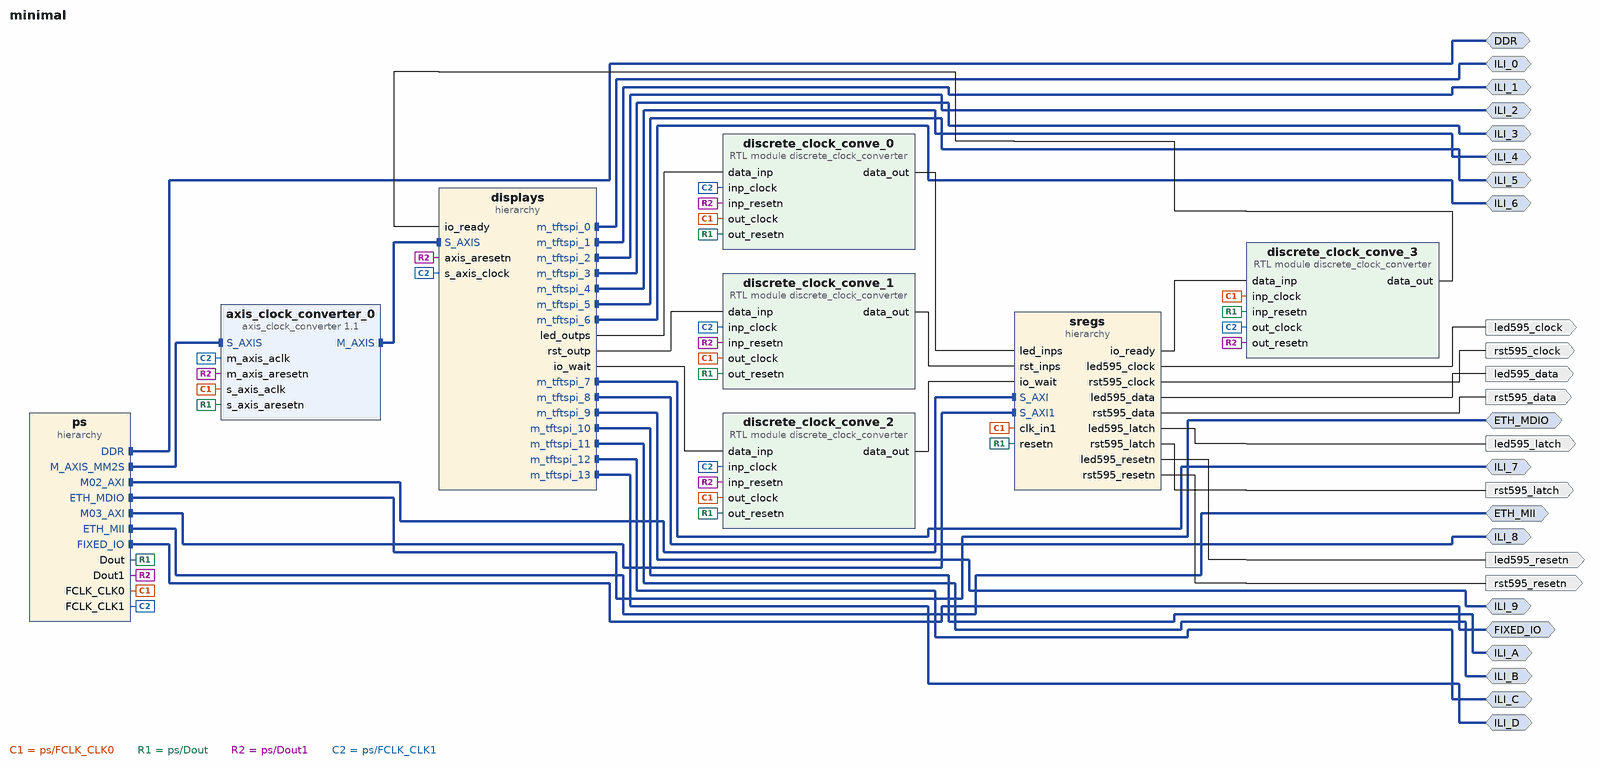
[diagram p0: block diagram of the top level]
# Vivado block design minimal, xc7z010clg400-1, Vivado 2025.2
create_bd_design minimal

create_bd_intf_port -mode Master -vlnv xilinx.com:interface:ddrx_rtl:1.0 DDR
create_bd_intf_port -mode Master -vlnv xilinx.com:display_processing_system7:fixedio_rtl:1.0 FIXED_IO
create_bd_intf_port -mode Master -vlnv xilinx.com:interface:mdio_rtl:1.0 ETH_MDIO
create_bd_intf_port -mode Master -vlnv xilinx.com:interface:mii_rtl:1.0 ETH_MII
create_bd_intf_port -mode Master -vlnv kn4hji.ddns.net:interface:tftspi_rtl:1.0 ILI_1
create_bd_intf_port -mode Master -vlnv kn4hji.ddns.net:interface:tftspi_rtl:1.0 ILI_5
create_bd_intf_port -mode Master -vlnv kn4hji.ddns.net:interface:tftspi_rtl:1.0 ILI_D
create_bd_intf_port -mode Master -vlnv kn4hji.ddns.net:interface:tftspi_rtl:1.0 ILI_C
create_bd_intf_port -mode Master -vlnv kn4hji.ddns.net:interface:tftspi_rtl:1.0 ILI_B
create_bd_intf_port -mode Master -vlnv kn4hji.ddns.net:interface:tftspi_rtl:1.0 ILI_0
create_bd_intf_port -mode Master -vlnv kn4hji.ddns.net:interface:tftspi_rtl:1.0 ILI_A
create_bd_intf_port -mode Master -vlnv kn4hji.ddns.net:interface:tftspi_rtl:1.0 ILI_2
create_bd_intf_port -mode Master -vlnv kn4hji.ddns.net:interface:tftspi_rtl:1.0 ILI_3
create_bd_intf_port -mode Master -vlnv kn4hji.ddns.net:interface:tftspi_rtl:1.0 ILI_4
create_bd_intf_port -mode Master -vlnv kn4hji.ddns.net:interface:tftspi_rtl:1.0 ILI_6
create_bd_intf_port -mode Master -vlnv kn4hji.ddns.net:interface:tftspi_rtl:1.0 ILI_7
create_bd_intf_port -mode Master -vlnv kn4hji.ddns.net:interface:tftspi_rtl:1.0 ILI_8
create_bd_intf_port -mode Master -vlnv kn4hji.ddns.net:interface:tftspi_rtl:1.0 ILI_9
create_bd_port -dir O -type clk rst595_clock
set_property -dict {CONFIG.ASSOCIATED_RESET rst595_resetn CONFIG.FREQ_HZ 25000000} [get_bd_ports rst595_clock]
create_bd_port -dir O rst595_latch
create_bd_port -dir O -type rst rst595_resetn
create_bd_port -dir O rst595_data
create_bd_port -dir O -type clk led595_clock
set_property -dict {CONFIG.ASSOCIATED_RESET led595_resetn CONFIG.FREQ_HZ 25000000} [get_bd_ports led595_clock]
create_bd_port -dir O led595_latch
create_bd_port -dir O -type rst led595_resetn
create_bd_port -dir O led595_data

create_bd_cell -type hier sregs
create_bd_cell -type hier displays
create_bd_cell -type hier ps
create_bd_cell -type ip -vlnv xilinx.com:ip:axis_clock_converter:1.1 axis_clock_converter_0
create_bd_cell -type module -reference discrete_clock_converter discrete_clock_conve_0
set_property -dict {CONFIG.DATA_WIDTH 14} [get_bd_cells discrete_clock_conve_0]
create_bd_cell -type module -reference discrete_clock_converter discrete_clock_conve_1
set_property -dict {CONFIG.DATA_WIDTH 14} [get_bd_cells discrete_clock_conve_1]
create_bd_cell -type module -reference discrete_clock_converter discrete_clock_conve_2
set_property -dict {CONFIG.DATA_WIDTH 1 CONFIG.RESET_VAL 1} [get_bd_cells discrete_clock_conve_2]
create_bd_cell -type module -reference discrete_clock_converter discrete_clock_conve_3
set_property -dict {CONFIG.DATA_WIDTH 1} [get_bd_cells discrete_clock_conve_3]

# ---- hierarchy /sregs ----
current_bd_instance /sregs
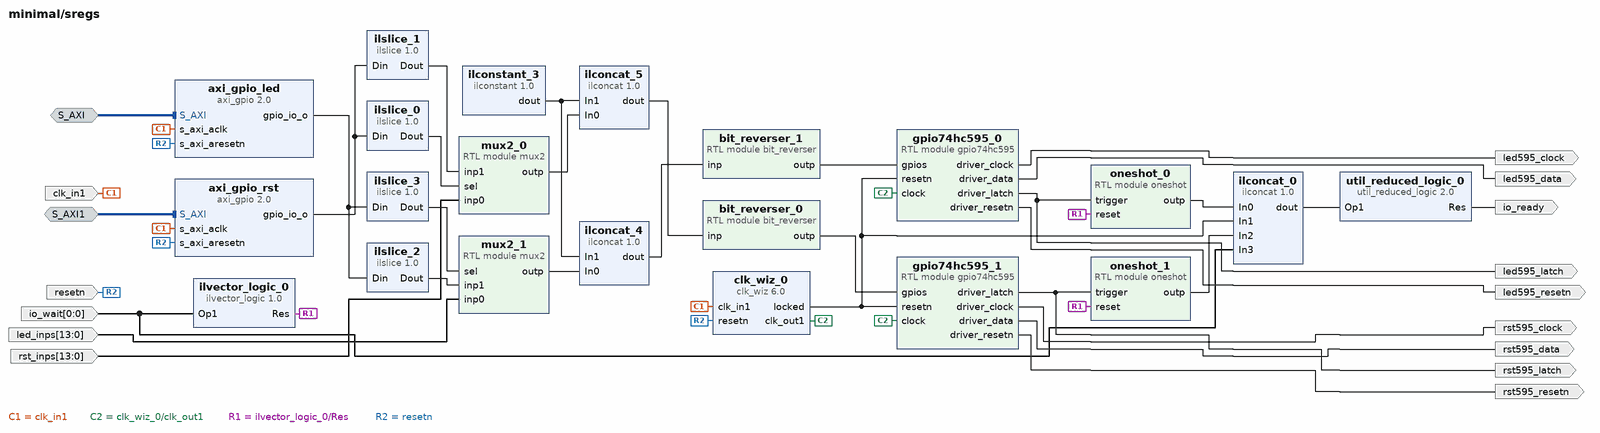
[diagram p1: block diagram inside /sregs]
create_bd_intf_pin -mode Slave -vlnv xilinx.com:interface:aximm_rtl:1.0 S_AXI
create_bd_intf_pin -mode Slave -vlnv xilinx.com:interface:aximm_rtl:1.0 S_AXI1
create_bd_pin -dir O -type clk led595_clock
create_bd_pin -dir O led595_latch
create_bd_pin -dir O -type rst led595_resetn
create_bd_pin -dir O led595_data
create_bd_pin -dir O -type clk rst595_clock
create_bd_pin -dir O rst595_latch
create_bd_pin -dir O -type rst rst595_resetn
create_bd_pin -dir O rst595_data
create_bd_pin -dir I -type rst resetn
create_bd_pin -dir I -type clk clk_in1
create_bd_pin -dir I -from 0 -to 0 io_wait
create_bd_pin -dir O io_ready
create_bd_pin -dir I -from 13 -to 0 led_inps
create_bd_pin -dir I -from 13 -to 0 rst_inps

create_bd_cell -type inline_hdl -vlnv xilinx.com:inline_hdl:ilconcat:1.0 ilconcat_4
set_property -dict {CONFIG.IN0_WIDTH 14 CONFIG.IN1_WIDTH 10 CONFIG.NUM_PORTS 2} [get_bd_cells ilconcat_4]
create_bd_cell -type ip -vlnv xilinx.com:ip:clk_wiz:6.0 clk_wiz_0
set_property -dict [list \
  CONFIG.CLKOUT1_DRIVES BUFGCE \
  CONFIG.CLKOUT1_JITTER 251.196 \
  CONFIG.CLKOUT1_PHASE_ERROR 114.212 \
  CONFIG.CLKOUT1_REQUESTED_OUT_FREQ 6.25 \
  CONFIG.CLKOUT2_DRIVES BUFGCE \
  CONFIG.CLKOUT3_DRIVES BUFGCE \
  CONFIG.CLKOUT4_DRIVES BUFGCE \
  CONFIG.CLKOUT5_DRIVES BUFGCE \
  CONFIG.CLKOUT6_DRIVES BUFGCE \
  CONFIG.CLKOUT7_DRIVES BUFGCE \
  CONFIG.ENABLE_CLOCK_MONITOR false \
  CONFIG.FEEDBACK_SOURCE FDBK_AUTO \
  CONFIG.MMCM_BANDWIDTH OPTIMIZED \
  CONFIG.MMCM_CLKFBOUT_MULT_F 8 \
  CONFIG.MMCM_CLKIN1_PERIOD 10.0 \
  CONFIG.MMCM_CLKIN2_PERIOD 10.0 \
  CONFIG.MMCM_CLKOUT0_DIVIDE_F 128 \
  CONFIG.MMCM_COMPENSATION ZHOLD \
  CONFIG.MMCM_DIVCLK_DIVIDE 1 \
  CONFIG.PRIMITIVE PLL \
  CONFIG.RESET_PORT resetn \
  CONFIG.RESET_TYPE ACTIVE_LOW \
  CONFIG.SECONDARY_SOURCE Single_ended_clock_capable_pin \
  CONFIG.USE_FREQ_SYNTH true \
  CONFIG.USE_LOCKED true \
  CONFIG.USE_PHASE_ALIGNMENT true \
  CONFIG.USE_SAFE_CLOCK_STARTUP true \
] [get_bd_cells clk_wiz_0]
create_bd_cell -type inline_hdl -vlnv xilinx.com:inline_hdl:ilconstant:1.0 ilconstant_3
set_property -dict {CONFIG.CONST_VAL 0x0000 CONFIG.CONST_WIDTH 10} [get_bd_cells ilconstant_3]
create_bd_cell -type module -reference gpio74hc595 gpio74hc595_0
set_property -dict {CONFIG.REGISTER_COUNT 3} [get_bd_cells gpio74hc595_0]
create_bd_cell -type module -reference gpio74hc595 gpio74hc595_1
set_property -dict {CONFIG.REGISTER_COUNT 3} [get_bd_cells gpio74hc595_1]
create_bd_cell -type inline_hdl -vlnv xilinx.com:inline_hdl:ilconcat:1.0 ilconcat_0
set_property -dict {CONFIG.NUM_PORTS 4} [get_bd_cells ilconcat_0]
create_bd_cell -type ip -vlnv xilinx.com:ip:util_reduced_logic:2.0 util_reduced_logic_0
set_property -dict {CONFIG.C_OPERATION and CONFIG.C_SIZE 4} [get_bd_cells util_reduced_logic_0]
create_bd_cell -type module -reference oneshot oneshot_0
create_bd_cell -type module -reference oneshot oneshot_1
create_bd_cell -type inline_hdl -vlnv xilinx.com:inline_hdl:ilvector_logic:1.0 ilvector_logic_0
set_property -dict {CONFIG.C_OPERATION not CONFIG.C_SIZE 1} [get_bd_cells ilvector_logic_0]
create_bd_cell -type module -reference mux2 mux2_1
set_property -dict {CONFIG.DATA_WIDTH 14} [get_bd_cells mux2_1]
create_bd_cell -type module -reference mux2 mux2_0
set_property -dict {CONFIG.DATA_WIDTH 14} [get_bd_cells mux2_0]
create_bd_cell -type inline_hdl -vlnv xilinx.com:inline_hdl:ilslice:1.0 ilslice_1
set_property -dict {CONFIG.DIN_FROM 13 CONFIG.DIN_TO 0 CONFIG.DIN_WIDTH 15} [get_bd_cells ilslice_1]
create_bd_cell -type inline_hdl -vlnv xilinx.com:inline_hdl:ilslice:1.0 ilslice_0
set_property -dict {CONFIG.DIN_FROM 14 CONFIG.DIN_TO 14 CONFIG.DIN_WIDTH 15} [get_bd_cells ilslice_0]
create_bd_cell -type inline_hdl -vlnv xilinx.com:inline_hdl:ilslice:1.0 ilslice_2
set_property -dict {CONFIG.DIN_FROM 13 CONFIG.DIN_TO 0 CONFIG.DIN_WIDTH 15} [get_bd_cells ilslice_2]
create_bd_cell -type inline_hdl -vlnv xilinx.com:inline_hdl:ilslice:1.0 ilslice_3
set_property -dict {CONFIG.DIN_FROM 14 CONFIG.DIN_TO 14 CONFIG.DIN_WIDTH 15} [get_bd_cells ilslice_3]
create_bd_cell -type ip -vlnv xilinx.com:ip:axi_gpio:2.0 axi_gpio_led
set_property -dict {CONFIG.C_ALL_OUTPUTS 1 CONFIG.C_GPIO_WIDTH 15} [get_bd_cells axi_gpio_led]
create_bd_cell -type ip -vlnv xilinx.com:ip:axi_gpio:2.0 axi_gpio_rst
set_property -dict {CONFIG.C_ALL_OUTPUTS 1 CONFIG.C_GPIO_WIDTH 15} [get_bd_cells axi_gpio_rst]
create_bd_cell -type module -reference bit_reverser bit_reverser_0
set_property -dict {CONFIG.WORD_COUNT 1 CONFIG.WORD_SIZE 24} [get_bd_cells bit_reverser_0]
create_bd_cell -type module -reference bit_reverser bit_reverser_1
set_property -dict {CONFIG.WORD_COUNT 1 CONFIG.WORD_SIZE 24} [get_bd_cells bit_reverser_1]
create_bd_cell -type inline_hdl -vlnv xilinx.com:inline_hdl:ilconcat:1.0 ilconcat_5
set_property -dict {CONFIG.IN0_WIDTH 14 CONFIG.IN1_WIDTH 10 CONFIG.NUM_PORTS 2} [get_bd_cells ilconcat_5]

# ---- hierarchy /displays ----
current_bd_instance /displays
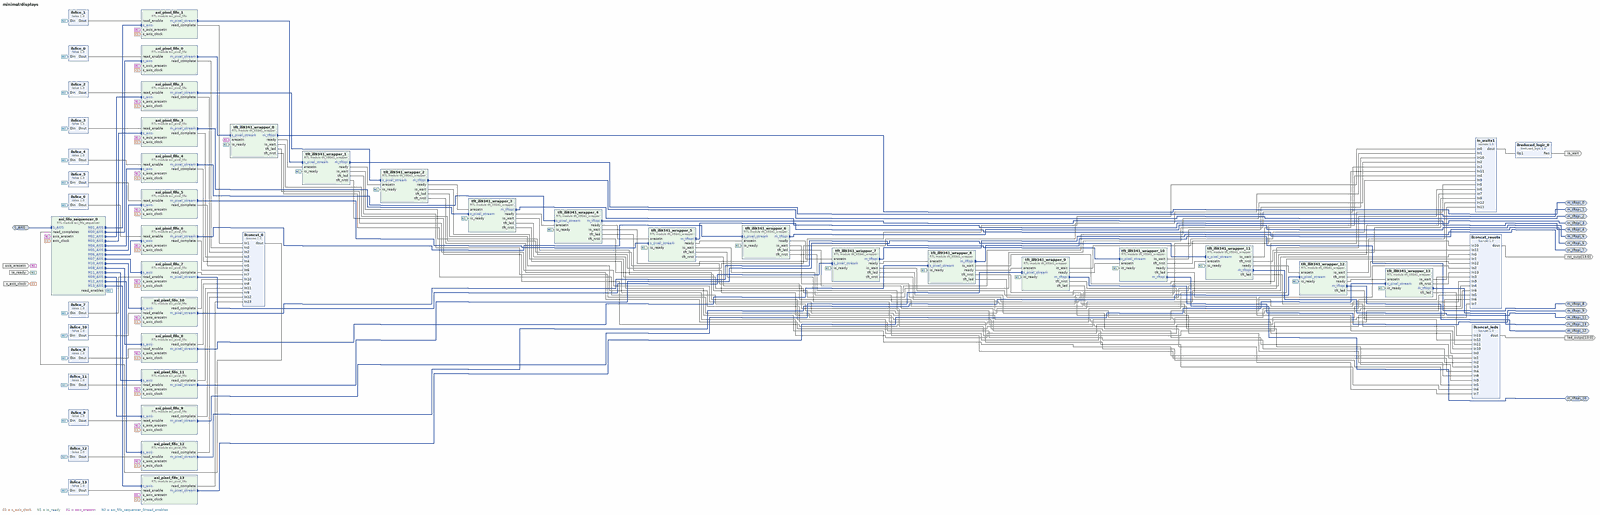
[diagram p2: block diagram inside /displays, whole]
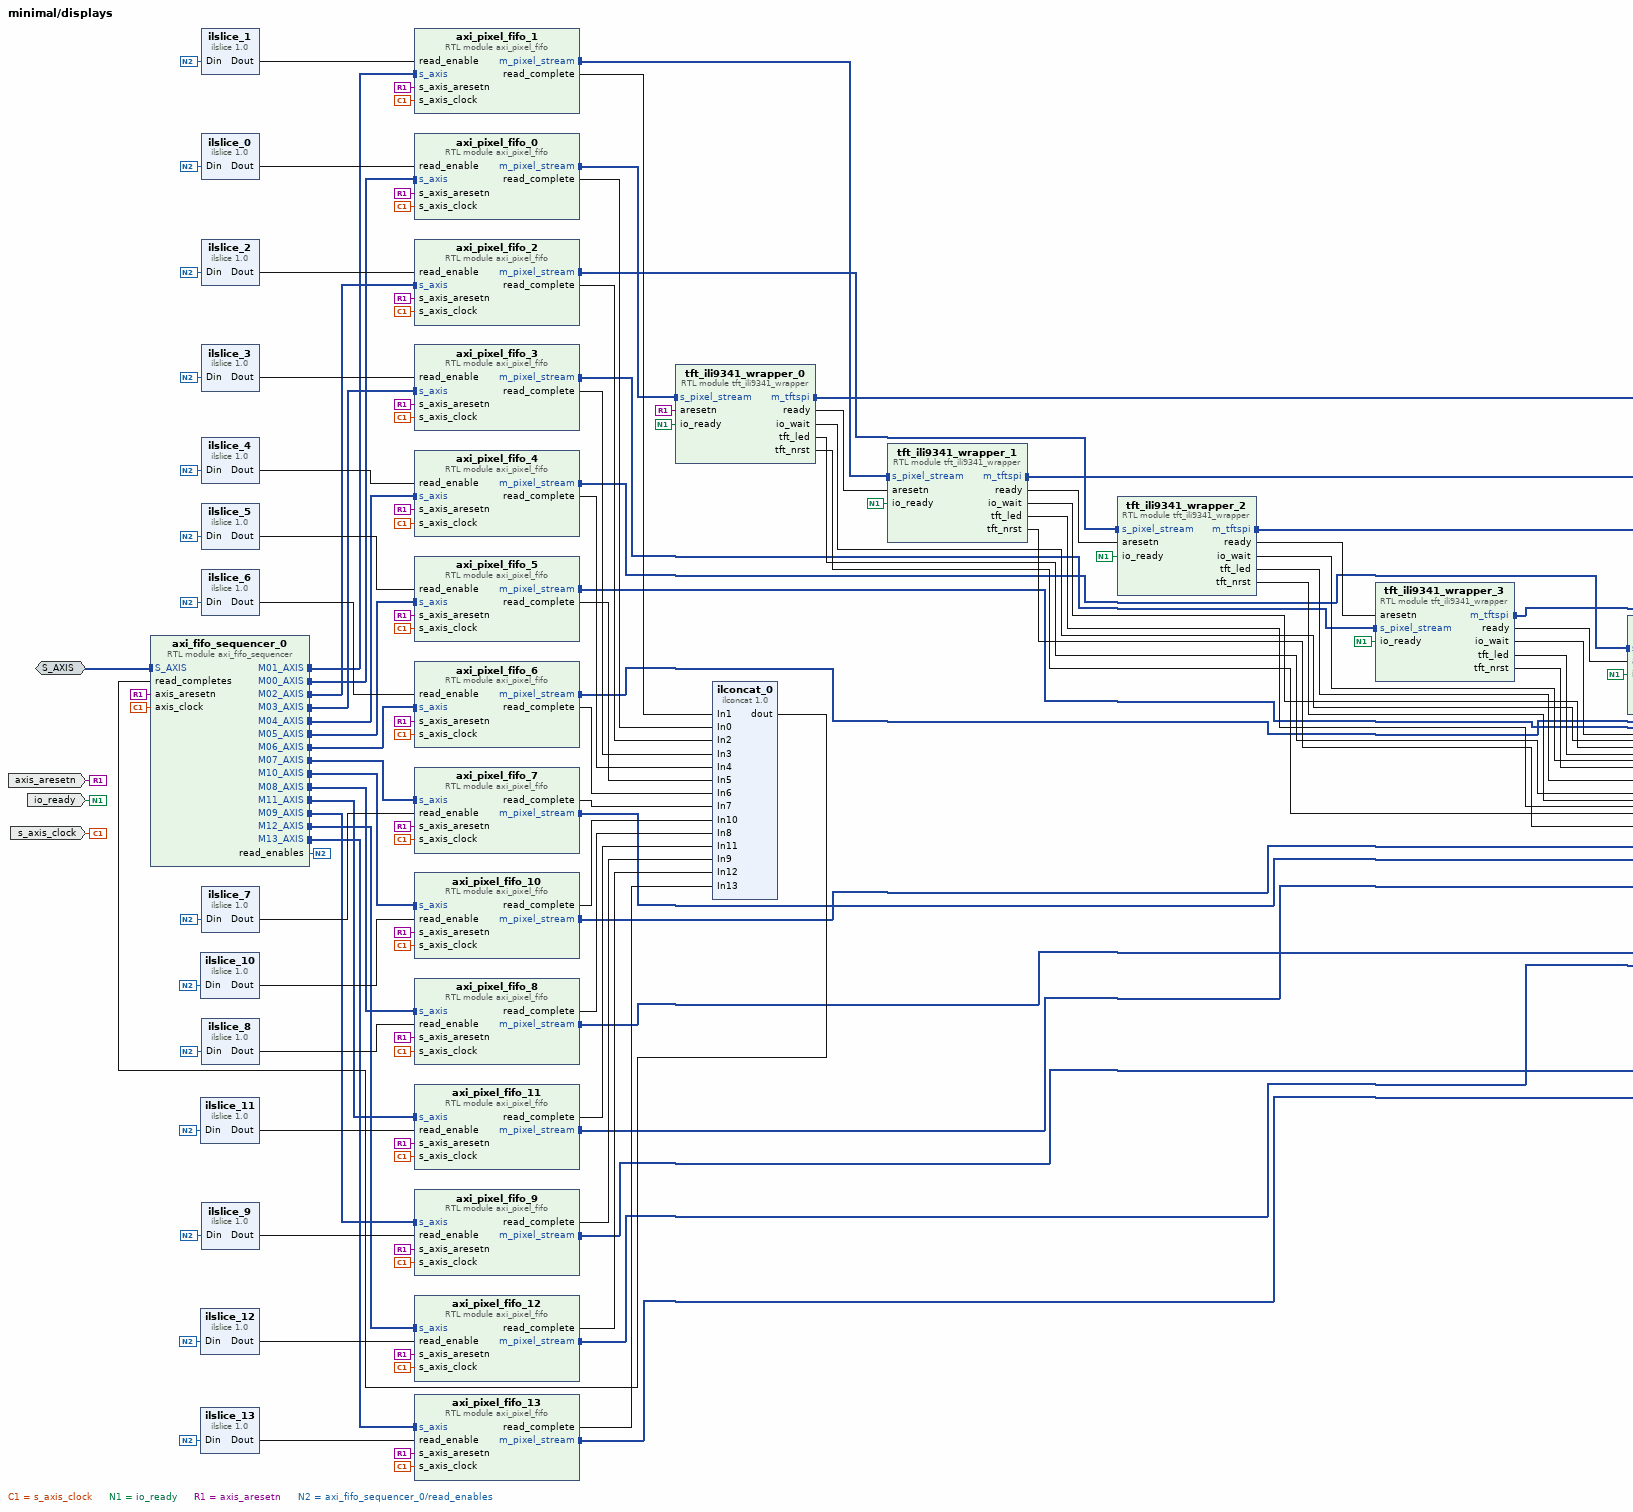
[diagram p3: block diagram inside /displays, left part]
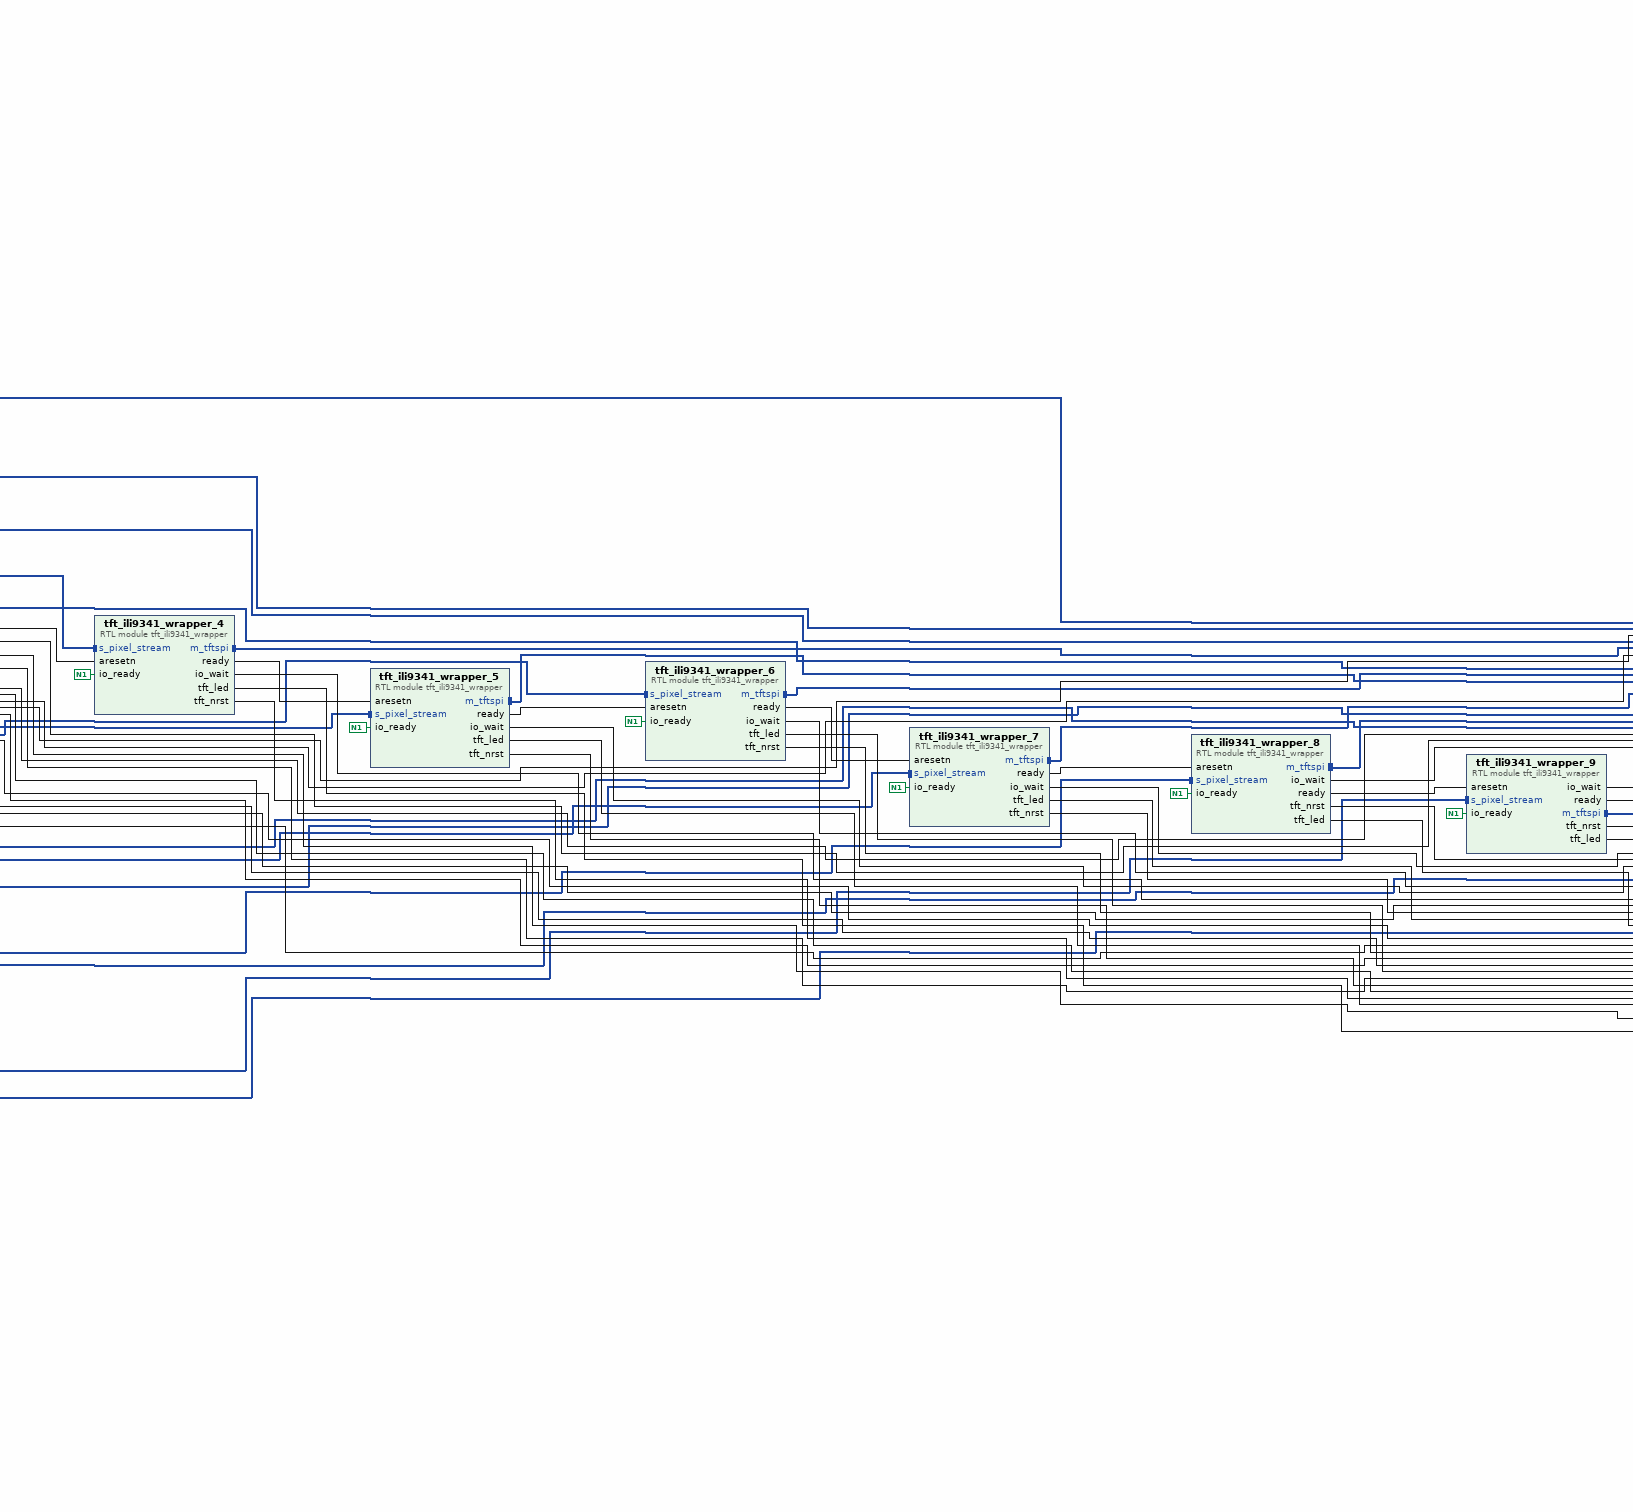
[diagram p4: block diagram inside /displays, centre part]
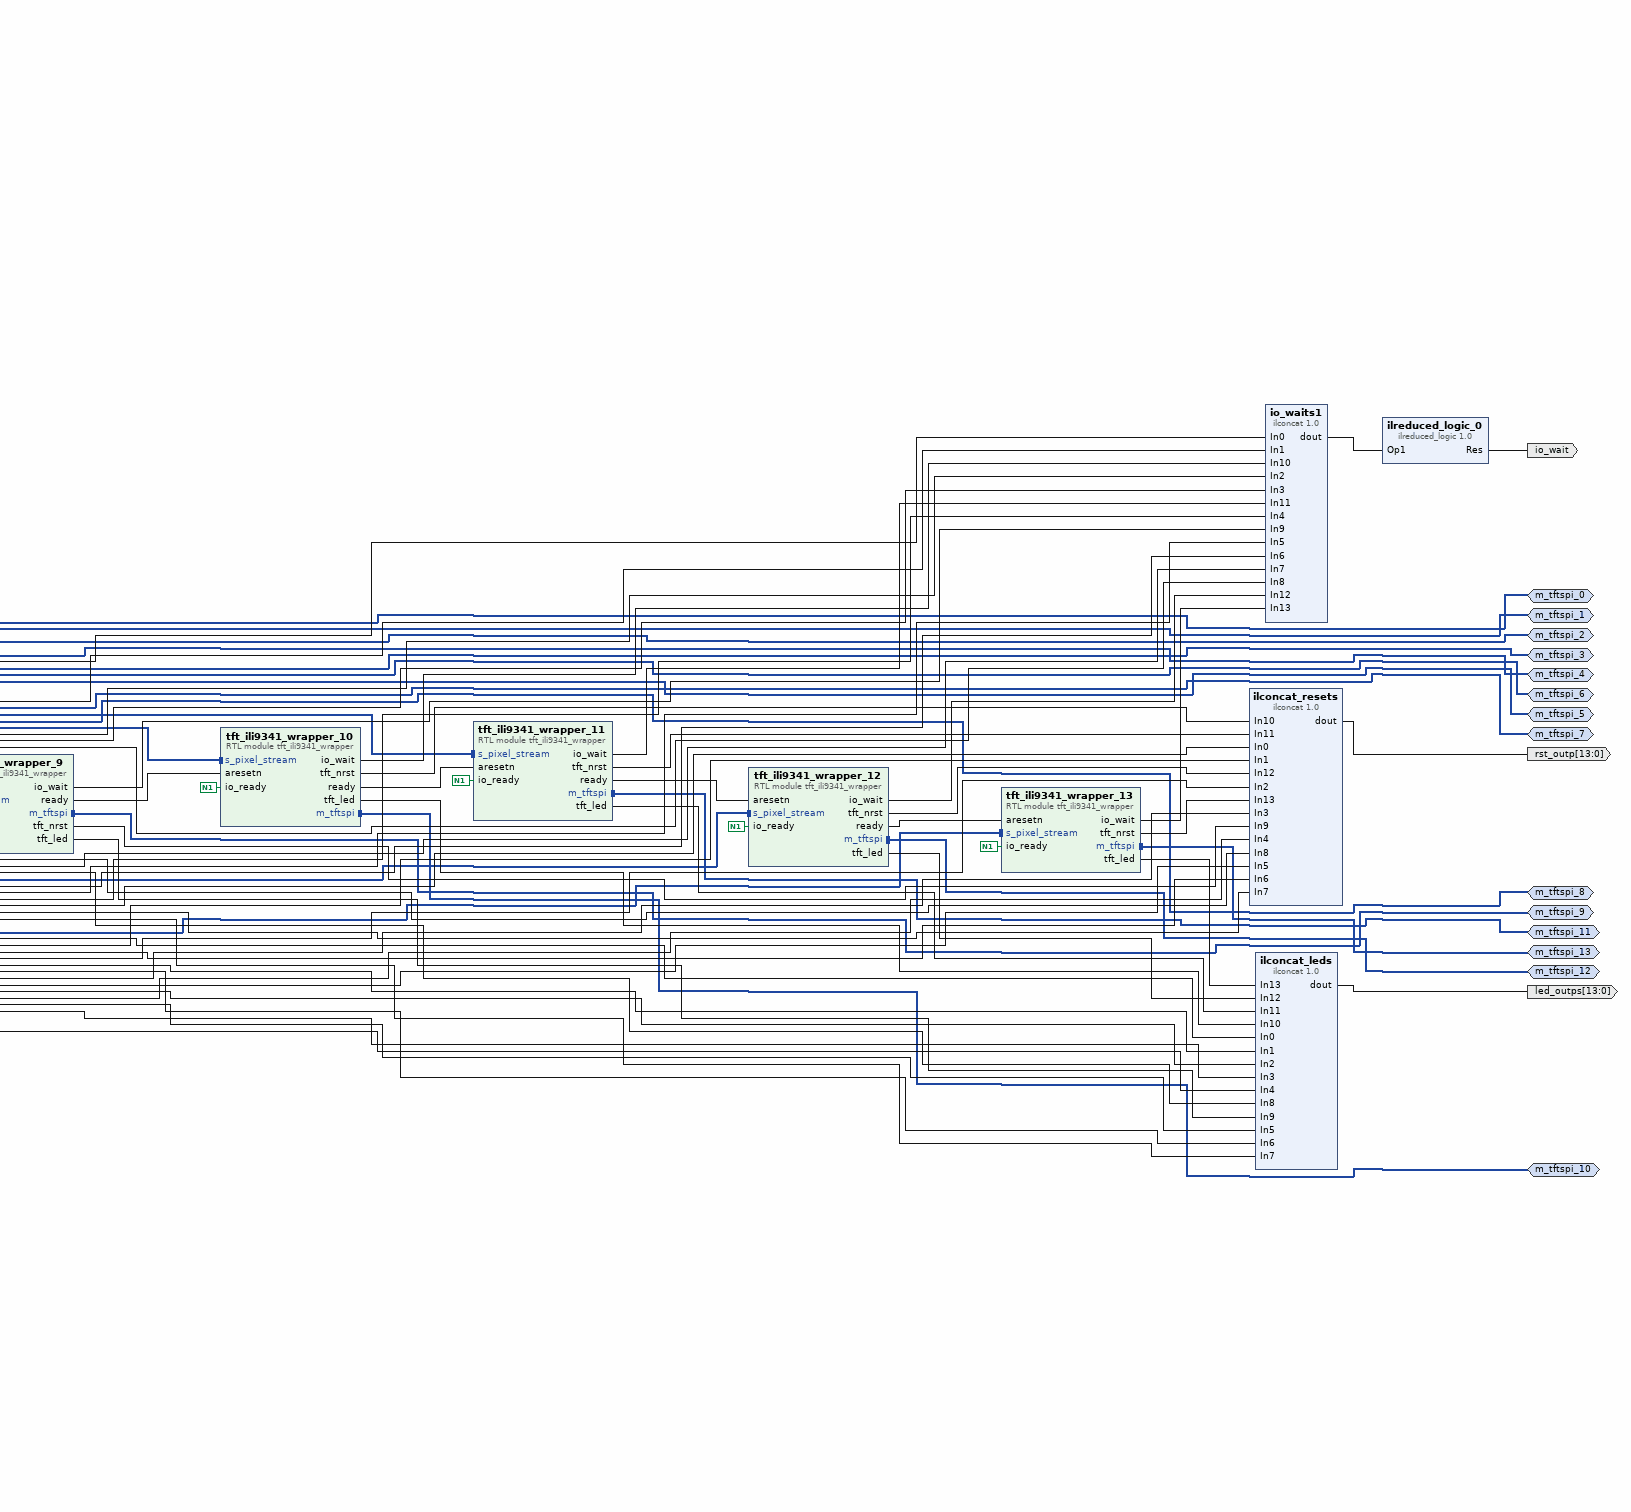
[diagram p5: block diagram inside /displays, right part]
create_bd_intf_pin -mode Master -vlnv kn4hji.ddns.net:interface:tftspi_rtl:1.0 m_tftspi_0
create_bd_intf_pin -mode Master -vlnv kn4hji.ddns.net:interface:tftspi_rtl:1.0 m_tftspi_2
create_bd_intf_pin -mode Master -vlnv kn4hji.ddns.net:interface:tftspi_rtl:1.0 m_tftspi_4
create_bd_intf_pin -mode Master -vlnv kn4hji.ddns.net:interface:tftspi_rtl:1.0 m_tftspi_3
create_bd_intf_pin -mode Master -vlnv kn4hji.ddns.net:interface:tftspi_rtl:1.0 m_tftspi_6
create_bd_intf_pin -mode Master -vlnv kn4hji.ddns.net:interface:tftspi_rtl:1.0 m_tftspi_7
create_bd_intf_pin -mode Master -vlnv kn4hji.ddns.net:interface:tftspi_rtl:1.0 m_tftspi_8
create_bd_intf_pin -mode Master -vlnv kn4hji.ddns.net:interface:tftspi_rtl:1.0 m_tftspi_9
create_bd_intf_pin -mode Master -vlnv kn4hji.ddns.net:interface:tftspi_rtl:1.0 m_tftspi_10
create_bd_intf_pin -mode Master -vlnv kn4hji.ddns.net:interface:tftspi_rtl:1.0 m_tftspi_11
create_bd_intf_pin -mode Master -vlnv kn4hji.ddns.net:interface:tftspi_rtl:1.0 m_tftspi_12
create_bd_intf_pin -mode Master -vlnv kn4hji.ddns.net:interface:tftspi_rtl:1.0 m_tftspi_13
create_bd_intf_pin -mode Master -vlnv kn4hji.ddns.net:interface:tftspi_rtl:1.0 m_tftspi_5
create_bd_intf_pin -mode Master -vlnv kn4hji.ddns.net:interface:tftspi_rtl:1.0 m_tftspi_1
create_bd_intf_pin -mode Slave -vlnv xilinx.com:interface:axis_rtl:1.0 S_AXIS
create_bd_pin -dir I -type clk s_axis_clock
create_bd_pin -dir I -type rst axis_aresetn
create_bd_pin -dir O -from 13 -to 0 rst_outp
create_bd_pin -dir O -from 13 -to 0 led_outps
create_bd_pin -dir I -type rst io_ready
create_bd_pin -dir O io_wait

create_bd_cell -type module -reference tft_ili9341_wrapper tft_ili9341_wrapper_0
set_property -dict {CONFIG.INPUT_CLK_MHZ 60} [get_bd_cells tft_ili9341_wrapper_0]
create_bd_cell -type module -reference axi_pixel_fifo axi_pixel_fifo_0
create_bd_cell -type module -reference axi_fifo_sequencer axi_fifo_sequencer_0
set_property -dict {CONFIG.LAST_DISPLAY 13 CONFIG.MAX_DISPLAYS 14} [get_bd_cells axi_fifo_sequencer_0]
create_bd_cell -type module -reference axi_pixel_fifo axi_pixel_fifo_1
create_bd_cell -type module -reference axi_pixel_fifo axi_pixel_fifo_2
create_bd_cell -type module -reference axi_pixel_fifo axi_pixel_fifo_3
create_bd_cell -type module -reference axi_pixel_fifo axi_pixel_fifo_4
create_bd_cell -type module -reference axi_pixel_fifo axi_pixel_fifo_5
create_bd_cell -type module -reference axi_pixel_fifo axi_pixel_fifo_6
create_bd_cell -type module -reference axi_pixel_fifo axi_pixel_fifo_7
create_bd_cell -type module -reference axi_pixel_fifo axi_pixel_fifo_8
create_bd_cell -type module -reference axi_pixel_fifo axi_pixel_fifo_9
create_bd_cell -type module -reference axi_pixel_fifo axi_pixel_fifo_10
create_bd_cell -type module -reference axi_pixel_fifo axi_pixel_fifo_11
create_bd_cell -type module -reference axi_pixel_fifo axi_pixel_fifo_12
create_bd_cell -type module -reference axi_pixel_fifo axi_pixel_fifo_13
create_bd_cell -type inline_hdl -vlnv xilinx.com:inline_hdl:ilslice:1.0 ilslice_0
set_property -dict {CONFIG.DIN_WIDTH 14} [get_bd_cells ilslice_0]
create_bd_cell -type inline_hdl -vlnv xilinx.com:inline_hdl:ilslice:1.0 ilslice_1
set_property -dict {CONFIG.DIN_FROM 1 CONFIG.DIN_TO 1 CONFIG.DIN_WIDTH 14} [get_bd_cells ilslice_1]
create_bd_cell -type inline_hdl -vlnv xilinx.com:inline_hdl:ilslice:1.0 ilslice_2
set_property -dict {CONFIG.DIN_FROM 2 CONFIG.DIN_TO 2 CONFIG.DIN_WIDTH 14} [get_bd_cells ilslice_2]
create_bd_cell -type inline_hdl -vlnv xilinx.com:inline_hdl:ilslice:1.0 ilslice_3
set_property -dict {CONFIG.DIN_FROM 3 CONFIG.DIN_TO 3 CONFIG.DIN_WIDTH 14} [get_bd_cells ilslice_3]
create_bd_cell -type inline_hdl -vlnv xilinx.com:inline_hdl:ilslice:1.0 ilslice_4
set_property -dict {CONFIG.DIN_FROM 4 CONFIG.DIN_TO 4 CONFIG.DIN_WIDTH 14} [get_bd_cells ilslice_4]
create_bd_cell -type inline_hdl -vlnv xilinx.com:inline_hdl:ilslice:1.0 ilslice_5
set_property -dict {CONFIG.DIN_FROM 5 CONFIG.DIN_TO 5 CONFIG.DIN_WIDTH 14} [get_bd_cells ilslice_5]
create_bd_cell -type inline_hdl -vlnv xilinx.com:inline_hdl:ilslice:1.0 ilslice_6
set_property -dict {CONFIG.DIN_FROM 6 CONFIG.DIN_TO 6 CONFIG.DIN_WIDTH 14} [get_bd_cells ilslice_6]
create_bd_cell -type inline_hdl -vlnv xilinx.com:inline_hdl:ilslice:1.0 ilslice_7
set_property -dict {CONFIG.DIN_FROM 7 CONFIG.DIN_TO 7 CONFIG.DIN_WIDTH 14} [get_bd_cells ilslice_7]
create_bd_cell -type inline_hdl -vlnv xilinx.com:inline_hdl:ilslice:1.0 ilslice_8
set_property -dict {CONFIG.DIN_FROM 8 CONFIG.DIN_TO 8 CONFIG.DIN_WIDTH 14} [get_bd_cells ilslice_8]
create_bd_cell -type inline_hdl -vlnv xilinx.com:inline_hdl:ilslice:1.0 ilslice_9
set_property -dict {CONFIG.DIN_FROM 9 CONFIG.DIN_TO 9 CONFIG.DIN_WIDTH 14} [get_bd_cells ilslice_9]
create_bd_cell -type inline_hdl -vlnv xilinx.com:inline_hdl:ilslice:1.0 ilslice_10
set_property -dict {CONFIG.DIN_FROM 10 CONFIG.DIN_TO 10 CONFIG.DIN_WIDTH 14} [get_bd_cells ilslice_10]
create_bd_cell -type inline_hdl -vlnv xilinx.com:inline_hdl:ilslice:1.0 ilslice_11
set_property -dict {CONFIG.DIN_FROM 11 CONFIG.DIN_TO 11 CONFIG.DIN_WIDTH 14} [get_bd_cells ilslice_11]
create_bd_cell -type inline_hdl -vlnv xilinx.com:inline_hdl:ilslice:1.0 ilslice_12
set_property -dict {CONFIG.DIN_FROM 12 CONFIG.DIN_TO 12 CONFIG.DIN_WIDTH 14} [get_bd_cells ilslice_12]
create_bd_cell -type inline_hdl -vlnv xilinx.com:inline_hdl:ilslice:1.0 ilslice_13
set_property -dict {CONFIG.DIN_FROM 13 CONFIG.DIN_TO 13 CONFIG.DIN_WIDTH 14} [get_bd_cells ilslice_13]
create_bd_cell -type module -reference tft_ili9341_wrapper tft_ili9341_wrapper_1
set_property -dict {CONFIG.INPUT_CLK_MHZ 60} [get_bd_cells tft_ili9341_wrapper_1]
create_bd_cell -type module -reference tft_ili9341_wrapper tft_ili9341_wrapper_2
set_property -dict {CONFIG.INPUT_CLK_MHZ 60} [get_bd_cells tft_ili9341_wrapper_2]
create_bd_cell -type module -reference tft_ili9341_wrapper tft_ili9341_wrapper_3
set_property -dict {CONFIG.INPUT_CLK_MHZ 60} [get_bd_cells tft_ili9341_wrapper_3]
create_bd_cell -type module -reference tft_ili9341_wrapper tft_ili9341_wrapper_4
set_property -dict {CONFIG.INPUT_CLK_MHZ 60} [get_bd_cells tft_ili9341_wrapper_4]
create_bd_cell -type module -reference tft_ili9341_wrapper tft_ili9341_wrapper_5
set_property -dict {CONFIG.INPUT_CLK_MHZ 60} [get_bd_cells tft_ili9341_wrapper_5]
create_bd_cell -type module -reference tft_ili9341_wrapper tft_ili9341_wrapper_6
set_property -dict {CONFIG.INPUT_CLK_MHZ 60} [get_bd_cells tft_ili9341_wrapper_6]
create_bd_cell -type module -reference tft_ili9341_wrapper tft_ili9341_wrapper_7
set_property -dict {CONFIG.INPUT_CLK_MHZ 60} [get_bd_cells tft_ili9341_wrapper_7]
create_bd_cell -type module -reference tft_ili9341_wrapper tft_ili9341_wrapper_8
set_property -dict {CONFIG.INPUT_CLK_MHZ 60} [get_bd_cells tft_ili9341_wrapper_8]
create_bd_cell -type module -reference tft_ili9341_wrapper tft_ili9341_wrapper_9
set_property -dict {CONFIG.INPUT_CLK_MHZ 60} [get_bd_cells tft_ili9341_wrapper_9]
create_bd_cell -type module -reference tft_ili9341_wrapper tft_ili9341_wrapper_10
set_property -dict {CONFIG.INPUT_CLK_MHZ 60} [get_bd_cells tft_ili9341_wrapper_10]
create_bd_cell -type module -reference tft_ili9341_wrapper tft_ili9341_wrapper_11
set_property -dict {CONFIG.INPUT_CLK_MHZ 60} [get_bd_cells tft_ili9341_wrapper_11]
create_bd_cell -type module -reference tft_ili9341_wrapper tft_ili9341_wrapper_12
set_property -dict {CONFIG.INPUT_CLK_MHZ 60} [get_bd_cells tft_ili9341_wrapper_12]
create_bd_cell -type module -reference tft_ili9341_wrapper tft_ili9341_wrapper_13
set_property -dict {CONFIG.INPUT_CLK_MHZ 60} [get_bd_cells tft_ili9341_wrapper_13]
create_bd_cell -type inline_hdl -vlnv xilinx.com:inline_hdl:ilconcat:1.0 ilconcat_0
set_property -dict {CONFIG.NUM_PORTS 14} [get_bd_cells ilconcat_0]
create_bd_cell -type inline_hdl -vlnv xilinx.com:inline_hdl:ilconcat:1.0 ilconcat_resets
set_property -dict {CONFIG.NUM_PORTS 14} [get_bd_cells ilconcat_resets]
create_bd_cell -type inline_hdl -vlnv xilinx.com:inline_hdl:ilconcat:1.0 ilconcat_leds
set_property -dict {CONFIG.NUM_PORTS 14} [get_bd_cells ilconcat_leds]
create_bd_cell -type inline_hdl -vlnv xilinx.com:inline_hdl:ilconcat:1.0 io_waits1
set_property -dict {CONFIG.NUM_PORTS 14} [get_bd_cells io_waits1]
create_bd_cell -type inline_hdl -vlnv xilinx.com:inline_hdl:ilreduced_logic:1.0 ilreduced_logic_0
set_property -dict {CONFIG.C_OPERATION or CONFIG.C_SIZE 14} [get_bd_cells ilreduced_logic_0]

# ---- hierarchy /ps ----
current_bd_instance /ps
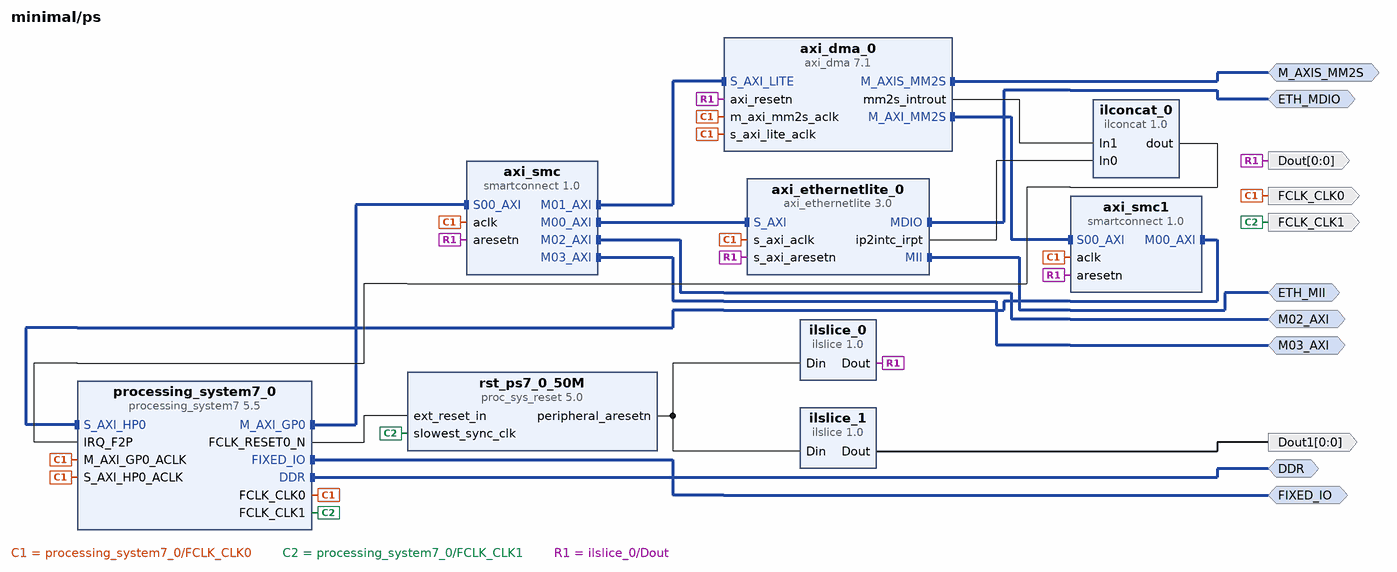
[diagram p6: block diagram inside /ps]
create_bd_intf_pin -mode Master -vlnv xilinx.com:interface:axis_rtl:1.0 M_AXIS_MM2S
create_bd_intf_pin -mode Master -vlnv xilinx.com:display_processing_system7:fixedio_rtl:1.0 FIXED_IO
create_bd_intf_pin -mode Master -vlnv xilinx.com:interface:ddrx_rtl:1.0 DDR
create_bd_intf_pin -mode Master -vlnv xilinx.com:interface:mdio_rtl:1.0 ETH_MDIO
create_bd_intf_pin -mode Master -vlnv xilinx.com:interface:mii_rtl:1.0 ETH_MII
create_bd_intf_pin -mode Master -vlnv xilinx.com:interface:aximm_rtl:1.0 M02_AXI
create_bd_intf_pin -mode Master -vlnv xilinx.com:interface:aximm_rtl:1.0 M03_AXI
create_bd_pin -dir O -type clk FCLK_CLK0
create_bd_pin -dir O -type clk FCLK_CLK1
create_bd_pin -dir O -from 0 -to 0 Dout
create_bd_pin -dir O -from 0 -to 0 Dout1

create_bd_cell -type ip -vlnv xilinx.com:ip:proc_sys_reset:5.0 rst_ps7_0_50M
set_property -dict {CONFIG.C_NUM_PERP_ARESETN 2} [get_bd_cells rst_ps7_0_50M]
create_bd_cell -type ip -vlnv xilinx.com:ip:smartconnect:1.0 axi_smc
set_property -dict {CONFIG.NUM_MI 4 CONFIG.NUM_SI 1} [get_bd_cells axi_smc]
create_bd_cell -type ip -vlnv xilinx.com:ip:processing_system7:5.5 processing_system7_0
set_property -dict [list \
  CONFIG.PCW_APU_PERIPHERAL_FREQMHZ 666.666666 \
  CONFIG.PCW_ENET0_PERIPHERAL_ENABLE 0 \
  CONFIG.PCW_EN_CLK1_PORT 1 \
  CONFIG.PCW_FCLK_CLK1_BUF TRUE \
  CONFIG.PCW_FPGA0_PERIPHERAL_FREQMHZ 100 \
  CONFIG.PCW_FPGA1_PERIPHERAL_FREQMHZ 60 \
  CONFIG.PCW_FPGA_FCLK1_ENABLE 1 \
  CONFIG.PCW_GPIO_MIO_GPIO_ENABLE 0 \
  CONFIG.PCW_IRQ_F2P_INTR 1 \
  CONFIG.PCW_PERIPHERAL_BOARD_PRESET None \
  CONFIG.PCW_PRESET_BANK1_VOLTAGE {LVCMOS 3.3V} \
  CONFIG.PCW_QSPI_GRP_SINGLE_SS_ENABLE 1 \
  CONFIG.PCW_QSPI_GRP_SINGLE_SS_IO {MIO 1 .. 6} \
  CONFIG.PCW_QSPI_PERIPHERAL_ENABLE 1 \
  CONFIG.PCW_QSPI_QSPI_IO {MIO 1 .. 6} \
  CONFIG.PCW_SD0_GRP_CD_ENABLE 0 \
  CONFIG.PCW_SD0_GRP_WP_ENABLE 0 \
  CONFIG.PCW_SD0_PERIPHERAL_ENABLE 1 \
  CONFIG.PCW_SD0_SD0_IO {MIO 40 .. 45} \
  CONFIG.PCW_SDIO_PERIPHERAL_FREQMHZ 100 \
  CONFIG.PCW_SINGLE_QSPI_DATA_MODE x4 \
  CONFIG.PCW_UART0_PERIPHERAL_ENABLE 1 \
  CONFIG.PCW_UART0_UART0_IO {MIO 14 .. 15} \
  CONFIG.PCW_UART1_PERIPHERAL_ENABLE 0 \
  CONFIG.PCW_UART_PERIPHERAL_FREQMHZ 100 \
  CONFIG.PCW_UIPARAM_DDR_BUS_WIDTH {16 Bit} \
  CONFIG.PCW_UIPARAM_DDR_FREQ_MHZ 534 \
  CONFIG.PCW_UIPARAM_DDR_MEMORY_TYPE {DDR 3 (Low Voltage)} \
  CONFIG.PCW_UIPARAM_DDR_PARTNO {MT41K256M16 RE-125} \
  CONFIG.PCW_USB0_PERIPHERAL_ENABLE 0 \
  CONFIG.PCW_USE_FABRIC_INTERRUPT 1 \
  CONFIG.PCW_USE_S_AXI_HP0 1 \
] [get_bd_cells processing_system7_0]
# 378 more settings of processing_system7_0 are not shown: defaults, MIO pin electricals, DDR timing, and values the tool derives
create_bd_cell -type ip -vlnv xilinx.com:ip:axi_ethernetlite:3.0 axi_ethernetlite_0
set_property -dict {CONFIG.AXI_ACLK_FREQ_MHZ 60} [get_bd_cells axi_ethernetlite_0]
create_bd_cell -type inline_hdl -vlnv xilinx.com:inline_hdl:ilconcat:1.0 ilconcat_0
set_property -dict [list \
  CONFIG.IN0_WIDTH 1 \
  CONFIG.IN1_WIDTH 1 \
  CONFIG.IN2_WIDTH 1 \
  CONFIG.IN3_WIDTH 1 \
  CONFIG.NUM_PORTS 2 \
] [get_bd_cells ilconcat_0]
create_bd_cell -type ip -vlnv xilinx.com:ip:axi_dma:7.1 axi_dma_0
set_property -dict [list \
  CONFIG.c_include_s2mm 0 \
  CONFIG.c_include_sg 0 \
  CONFIG.c_m_axis_mm2s_tdata_width 16 \
  CONFIG.c_sg_length_width 26 \
] [get_bd_cells axi_dma_0]
create_bd_cell -type ip -vlnv xilinx.com:ip:smartconnect:1.0 axi_smc1
set_property -dict {CONFIG.NUM_MI 1 CONFIG.NUM_SI 1} [get_bd_cells axi_smc1]
create_bd_cell -type inline_hdl -vlnv xilinx.com:inline_hdl:ilslice:1.0 ilslice_0
set_property -dict {CONFIG.DIN_WIDTH 2} [get_bd_cells ilslice_0]
create_bd_cell -type inline_hdl -vlnv xilinx.com:inline_hdl:ilslice:1.0 ilslice_1
set_property -dict {CONFIG.DIN_TO 1 CONFIG.DIN_WIDTH 2} [get_bd_cells ilslice_1]

# ---- connections ----

current_bd_instance /sregs
connect_bd_intf_net [get_bd_intf_pins axi_gpio_led/S_AXI] [get_bd_intf_pins S_AXI]
connect_bd_intf_net [get_bd_intf_pins axi_gpio_rst/S_AXI] [get_bd_intf_pins S_AXI1]
connect_bd_net -net Din1_1 [get_bd_pins axi_gpio_led/gpio_io_o] [get_bd_pins ilslice_2/Din] [get_bd_pins ilslice_3/Din]
connect_bd_net -net Din_1 [get_bd_pins axi_gpio_rst/gpio_io_o] [get_bd_pins ilslice_1/Din] [get_bd_pins ilslice_0/Din]
connect_bd_net -net In3_0_1 [get_bd_pins io_wait] [get_bd_pins ilconcat_0/In3] [get_bd_pins ilvector_logic_0/Op1]
connect_bd_net [get_bd_pins bit_reverser_0/outp] [get_bd_pins gpio74hc595_1/gpios]
connect_bd_net [get_bd_pins bit_reverser_1/outp] [get_bd_pins gpio74hc595_0/gpios]
connect_bd_net -net clk_in1_1 [get_bd_pins clk_in1] \
  [get_bd_pins clk_wiz_0/clk_in1] [get_bd_pins axi_gpio_led/s_axi_aclk] [get_bd_pins axi_gpio_rst/s_axi_aclk]
connect_bd_net [get_bd_pins clk_wiz_0/clk_out1] [get_bd_pins gpio74hc595_1/clock] [get_bd_pins gpio74hc595_0/clock]
connect_bd_net [get_bd_pins clk_wiz_0/locked] [get_bd_pins gpio74hc595_0/resetn] [get_bd_pins gpio74hc595_1/resetn] [get_bd_pins ilconcat_0/In1]
connect_bd_net [get_bd_pins gpio74hc595_0/driver_clock] [get_bd_pins led595_clock]
connect_bd_net [get_bd_pins gpio74hc595_0/driver_data] [get_bd_pins led595_data]
connect_bd_net [get_bd_pins gpio74hc595_0/driver_latch] [get_bd_pins led595_latch] [get_bd_pins oneshot_0/trigger]
connect_bd_net [get_bd_pins gpio74hc595_0/driver_resetn] [get_bd_pins led595_resetn]
connect_bd_net [get_bd_pins gpio74hc595_1/driver_clock] [get_bd_pins rst595_clock]
connect_bd_net [get_bd_pins gpio74hc595_1/driver_data] [get_bd_pins rst595_data]
connect_bd_net [get_bd_pins gpio74hc595_1/driver_latch] [get_bd_pins rst595_latch] [get_bd_pins oneshot_1/trigger]
connect_bd_net [get_bd_pins gpio74hc595_1/driver_resetn] [get_bd_pins rst595_resetn]
connect_bd_net [get_bd_pins ilconcat_0/dout] [get_bd_pins util_reduced_logic_0/Op1]
connect_bd_net [get_bd_pins ilconcat_4/dout] [get_bd_pins bit_reverser_1/inp]
connect_bd_net [get_bd_pins ilconcat_5/dout] [get_bd_pins bit_reverser_0/inp]
connect_bd_net [get_bd_pins ilconstant_3/dout] [get_bd_pins ilconcat_4/In1] [get_bd_pins ilconcat_5/In1]
connect_bd_net [get_bd_pins ilslice_0/Dout] [get_bd_pins mux2_0/sel]
connect_bd_net [get_bd_pins ilslice_1/Dout] [get_bd_pins mux2_0/inp1]
connect_bd_net [get_bd_pins ilslice_2/Dout] [get_bd_pins mux2_1/inp1]
connect_bd_net [get_bd_pins ilslice_3/Dout] [get_bd_pins mux2_1/sel]
connect_bd_net [get_bd_pins ilvector_logic_0/Res] [get_bd_pins oneshot_0/reset] [get_bd_pins oneshot_1/reset]
connect_bd_net -net inp0_1 [get_bd_pins led_inps] [get_bd_pins mux2_1/inp0]
connect_bd_net -net inp2_1 [get_bd_pins rst_inps] [get_bd_pins mux2_0/inp0]
connect_bd_net [get_bd_pins mux2_0/outp] [get_bd_pins ilconcat_5/In0]
connect_bd_net [get_bd_pins mux2_1/outp] [get_bd_pins ilconcat_4/In0]
connect_bd_net [get_bd_pins oneshot_0/outp] [get_bd_pins ilconcat_0/In0]
connect_bd_net [get_bd_pins oneshot_1/outp] [get_bd_pins ilconcat_0/In2]
connect_bd_net [get_bd_pins resetn] [get_bd_pins clk_wiz_0/resetn] [get_bd_pins axi_gpio_led/s_axi_aresetn] [get_bd_pins axi_gpio_rst/s_axi_aresetn]
connect_bd_net [get_bd_pins util_reduced_logic_0/Res] [get_bd_pins io_ready]

current_bd_instance /displays
connect_bd_intf_net [get_bd_intf_pins tft_ili9341_wrapper_0/m_tftspi] [get_bd_intf_pins m_tftspi_0]
connect_bd_intf_net [get_bd_intf_pins tft_ili9341_wrapper_1/m_tftspi] [get_bd_intf_pins m_tftspi_1]
connect_bd_intf_net [get_bd_intf_pins tft_ili9341_wrapper_2/m_tftspi] [get_bd_intf_pins m_tftspi_2]
connect_bd_intf_net [get_bd_intf_pins tft_ili9341_wrapper_4/m_tftspi] [get_bd_intf_pins m_tftspi_4]
connect_bd_intf_net [get_bd_intf_pins tft_ili9341_wrapper_3/m_tftspi] [get_bd_intf_pins m_tftspi_3]
connect_bd_intf_net [get_bd_intf_pins tft_ili9341_wrapper_6/m_tftspi] [get_bd_intf_pins m_tftspi_6]
connect_bd_intf_net [get_bd_intf_pins tft_ili9341_wrapper_7/m_tftspi] [get_bd_intf_pins m_tftspi_7]
connect_bd_intf_net [get_bd_intf_pins tft_ili9341_wrapper_8/m_tftspi] [get_bd_intf_pins m_tftspi_8]
connect_bd_intf_net [get_bd_intf_pins tft_ili9341_wrapper_9/m_tftspi] [get_bd_intf_pins m_tftspi_9]
connect_bd_intf_net [get_bd_intf_pins tft_ili9341_wrapper_10/m_tftspi] [get_bd_intf_pins m_tftspi_10]
connect_bd_intf_net [get_bd_intf_pins tft_ili9341_wrapper_11/m_tftspi] [get_bd_intf_pins m_tftspi_11]
connect_bd_intf_net [get_bd_intf_pins tft_ili9341_wrapper_12/m_tftspi] [get_bd_intf_pins m_tftspi_12]
connect_bd_intf_net [get_bd_intf_pins tft_ili9341_wrapper_13/m_tftspi] [get_bd_intf_pins m_tftspi_13]
connect_bd_intf_net [get_bd_intf_pins tft_ili9341_wrapper_5/m_tftspi] [get_bd_intf_pins m_tftspi_5]
connect_bd_intf_net [get_bd_intf_pins axi_fifo_sequencer_0/S_AXIS] [get_bd_intf_pins S_AXIS]
connect_bd_intf_net [get_bd_intf_pins axi_pixel_fifo_0/s_axis] [get_bd_intf_pins axi_fifo_sequencer_0/M00_AXIS]
connect_bd_intf_net [get_bd_intf_pins axi_fifo_sequencer_0/M01_AXIS] [get_bd_intf_pins axi_pixel_fifo_1/s_axis]
connect_bd_intf_net [get_bd_intf_pins axi_fifo_sequencer_0/M02_AXIS] [get_bd_intf_pins axi_pixel_fifo_2/s_axis]
connect_bd_intf_net [get_bd_intf_pins axi_fifo_sequencer_0/M03_AXIS] [get_bd_intf_pins axi_pixel_fifo_3/s_axis]
connect_bd_intf_net [get_bd_intf_pins axi_fifo_sequencer_0/M04_AXIS] [get_bd_intf_pins axi_pixel_fifo_4/s_axis]
connect_bd_intf_net [get_bd_intf_pins axi_fifo_sequencer_0/M05_AXIS] [get_bd_intf_pins axi_pixel_fifo_5/s_axis]
connect_bd_intf_net [get_bd_intf_pins axi_fifo_sequencer_0/M06_AXIS] [get_bd_intf_pins axi_pixel_fifo_6/s_axis]
connect_bd_intf_net [get_bd_intf_pins axi_fifo_sequencer_0/M07_AXIS] [get_bd_intf_pins axi_pixel_fifo_7/s_axis]
connect_bd_intf_net [get_bd_intf_pins axi_fifo_sequencer_0/M08_AXIS] [get_bd_intf_pins axi_pixel_fifo_8/s_axis]
connect_bd_intf_net [get_bd_intf_pins axi_pixel_fifo_9/s_axis] [get_bd_intf_pins axi_fifo_sequencer_0/M09_AXIS]
connect_bd_intf_net [get_bd_intf_pins axi_fifo_sequencer_0/M10_AXIS] [get_bd_intf_pins axi_pixel_fifo_10/s_axis]
connect_bd_intf_net [get_bd_intf_pins axi_fifo_sequencer_0/M11_AXIS] [get_bd_intf_pins axi_pixel_fifo_11/s_axis]
connect_bd_intf_net [get_bd_intf_pins axi_pixel_fifo_12/s_axis] [get_bd_intf_pins axi_fifo_sequencer_0/M12_AXIS]
connect_bd_intf_net [get_bd_intf_pins axi_fifo_sequencer_0/M13_AXIS] [get_bd_intf_pins axi_pixel_fifo_13/s_axis]
connect_bd_intf_net [get_bd_intf_pins axi_pixel_fifo_0/m_pixel_stream] [get_bd_intf_pins tft_ili9341_wrapper_0/s_pixel_stream]
connect_bd_intf_net [get_bd_intf_pins tft_ili9341_wrapper_10/s_pixel_stream] [get_bd_intf_pins axi_pixel_fifo_10/m_pixel_stream]
connect_bd_intf_net [get_bd_intf_pins tft_ili9341_wrapper_11/s_pixel_stream] [get_bd_intf_pins axi_pixel_fifo_11/m_pixel_stream]
connect_bd_intf_net [get_bd_intf_pins tft_ili9341_wrapper_12/s_pixel_stream] [get_bd_intf_pins axi_pixel_fifo_12/m_pixel_stream]
connect_bd_intf_net [get_bd_intf_pins axi_pixel_fifo_13/m_pixel_stream] [get_bd_intf_pins tft_ili9341_wrapper_13/s_pixel_stream]
connect_bd_intf_net [get_bd_intf_pins axi_pixel_fifo_1/m_pixel_stream] [get_bd_intf_pins tft_ili9341_wrapper_1/s_pixel_stream]
connect_bd_intf_net [get_bd_intf_pins tft_ili9341_wrapper_2/s_pixel_stream] [get_bd_intf_pins axi_pixel_fifo_2/m_pixel_stream]
connect_bd_intf_net [get_bd_intf_pins tft_ili9341_wrapper_3/s_pixel_stream] [get_bd_intf_pins axi_pixel_fifo_3/m_pixel_stream]
connect_bd_intf_net [get_bd_intf_pins tft_ili9341_wrapper_4/s_pixel_stream] [get_bd_intf_pins axi_pixel_fifo_4/m_pixel_stream]
connect_bd_intf_net [get_bd_intf_pins tft_ili9341_wrapper_5/s_pixel_stream] [get_bd_intf_pins axi_pixel_fifo_5/m_pixel_stream]
connect_bd_intf_net [get_bd_intf_pins tft_ili9341_wrapper_6/s_pixel_stream] [get_bd_intf_pins axi_pixel_fifo_6/m_pixel_stream]
connect_bd_intf_net [get_bd_intf_pins axi_pixel_fifo_7/m_pixel_stream] [get_bd_intf_pins tft_ili9341_wrapper_7/s_pixel_stream]
connect_bd_intf_net [get_bd_intf_pins tft_ili9341_wrapper_8/s_pixel_stream] [get_bd_intf_pins axi_pixel_fifo_8/m_pixel_stream]
connect_bd_intf_net [get_bd_intf_pins tft_ili9341_wrapper_9/s_pixel_stream] [get_bd_intf_pins axi_pixel_fifo_9/m_pixel_stream]
connect_bd_net [get_bd_pins s_axis_clock] \
  [get_bd_pins axi_pixel_fifo_0/s_axis_clock] [get_bd_pins axi_pixel_fifo_1/s_axis_clock] \
  [get_bd_pins axi_pixel_fifo_5/s_axis_clock] [get_bd_pins axi_pixel_fifo_11/s_axis_clock] \
  [get_bd_pins axi_pixel_fifo_12/s_axis_clock] [get_bd_pins axi_pixel_fifo_13/s_axis_clock] \
  [get_bd_pins axi_pixel_fifo_2/s_axis_clock] [get_bd_pins axi_pixel_fifo_6/s_axis_clock] \
  [get_bd_pins axi_pixel_fifo_3/s_axis_clock] [get_bd_pins axi_pixel_fifo_7/s_axis_clock] \
  [get_bd_pins axi_pixel_fifo_4/s_axis_clock] [get_bd_pins axi_pixel_fifo_8/s_axis_clock] \
  [get_bd_pins axi_pixel_fifo_9/s_axis_clock] [get_bd_pins axi_pixel_fifo_10/s_axis_clock] \
  [get_bd_pins axi_fifo_sequencer_0/axis_clock]
connect_bd_net [get_bd_pins io_ready] \
  [get_bd_pins tft_ili9341_wrapper_0/io_ready] [get_bd_pins tft_ili9341_wrapper_1/io_ready] \
  [get_bd_pins tft_ili9341_wrapper_11/io_ready] [get_bd_pins tft_ili9341_wrapper_12/io_ready] \
  [get_bd_pins tft_ili9341_wrapper_13/io_ready] [get_bd_pins tft_ili9341_wrapper_2/io_ready] \
  [get_bd_pins tft_ili9341_wrapper_3/io_ready] [get_bd_pins tft_ili9341_wrapper_4/io_ready] \
  [get_bd_pins tft_ili9341_wrapper_5/io_ready] [get_bd_pins tft_ili9341_wrapper_6/io_ready] \
  [get_bd_pins tft_ili9341_wrapper_7/io_ready] [get_bd_pins tft_ili9341_wrapper_8/io_ready] \
  [get_bd_pins tft_ili9341_wrapper_9/io_ready] [get_bd_pins tft_ili9341_wrapper_10/io_ready]
connect_bd_net [get_bd_pins axi_pixel_fifo_10/read_complete] [get_bd_pins ilconcat_0/In10]
connect_bd_net [get_bd_pins axi_pixel_fifo_11/read_complete] [get_bd_pins ilconcat_0/In11]
connect_bd_net [get_bd_pins axi_pixel_fifo_12/read_complete] [get_bd_pins ilconcat_0/In12]
connect_bd_net [get_bd_pins axi_pixel_fifo_1/read_complete] [get_bd_pins ilconcat_0/In1]
connect_bd_net [get_bd_pins axi_pixel_fifo_2/read_complete] [get_bd_pins ilconcat_0/In2]
connect_bd_net [get_bd_pins axi_pixel_fifo_3/read_complete] [get_bd_pins ilconcat_0/In3]
connect_bd_net [get_bd_pins axi_pixel_fifo_4/read_complete] [get_bd_pins ilconcat_0/In4]
connect_bd_net [get_bd_pins axi_pixel_fifo_5/read_complete] [get_bd_pins ilconcat_0/In5]
connect_bd_net [get_bd_pins axi_pixel_fifo_6/read_complete] [get_bd_pins ilconcat_0/In6]
connect_bd_net [get_bd_pins axi_pixel_fifo_7/read_complete] [get_bd_pins ilconcat_0/In7]
connect_bd_net [get_bd_pins axi_pixel_fifo_8/read_complete] [get_bd_pins ilconcat_0/In8]
connect_bd_net [get_bd_pins axi_pixel_fifo_9/read_complete] [get_bd_pins ilconcat_0/In9]
connect_bd_net [get_bd_pins axis_aresetn] \
  [get_bd_pins axi_pixel_fifo_0/s_axis_aresetn] [get_bd_pins axi_pixel_fifo_1/s_axis_aresetn] \
  [get_bd_pins axi_pixel_fifo_5/s_axis_aresetn] [get_bd_pins axi_pixel_fifo_11/s_axis_aresetn] \
  [get_bd_pins axi_pixel_fifo_12/s_axis_aresetn] [get_bd_pins axi_pixel_fifo_13/s_axis_aresetn] \
  [get_bd_pins axi_pixel_fifo_2/s_axis_aresetn] [get_bd_pins axi_pixel_fifo_6/s_axis_aresetn] \
  [get_bd_pins axi_pixel_fifo_3/s_axis_aresetn] [get_bd_pins axi_pixel_fifo_7/s_axis_aresetn] \
  [get_bd_pins axi_pixel_fifo_4/s_axis_aresetn] [get_bd_pins axi_pixel_fifo_8/s_axis_aresetn] \
  [get_bd_pins axi_pixel_fifo_9/s_axis_aresetn] [get_bd_pins axi_pixel_fifo_10/s_axis_aresetn] \
  [get_bd_pins tft_ili9341_wrapper_0/aresetn] [get_bd_pins axi_fifo_sequencer_0/axis_aresetn]
connect_bd_net -net display_0_read_complete [get_bd_pins axi_pixel_fifo_0/read_complete] [get_bd_pins ilconcat_0/In0]
connect_bd_net -net display_0_read_enable [get_bd_pins ilslice_0/Dout] [get_bd_pins axi_pixel_fifo_0/read_enable]
connect_bd_net -net display_13_read_complete [get_bd_pins axi_pixel_fifo_13/read_complete] [get_bd_pins ilconcat_0/In13]
connect_bd_net -net display_13_read_enable [get_bd_pins ilslice_13/Dout] [get_bd_pins axi_pixel_fifo_13/read_enable]
connect_bd_net [get_bd_pins ilconcat_leds/dout] [get_bd_pins led_outps]
connect_bd_net [get_bd_pins ilconcat_resets/dout] [get_bd_pins rst_outp]
connect_bd_net [get_bd_pins ilreduced_logic_0/Res] [get_bd_pins io_wait]
connect_bd_net [get_bd_pins ilslice_10/Dout] [get_bd_pins axi_pixel_fifo_10/read_enable]
connect_bd_net [get_bd_pins ilslice_11/Dout] [get_bd_pins axi_pixel_fifo_11/read_enable]
connect_bd_net [get_bd_pins ilslice_12/Dout] [get_bd_pins axi_pixel_fifo_12/read_enable]
connect_bd_net [get_bd_pins ilslice_1/Dout] [get_bd_pins axi_pixel_fifo_1/read_enable]
connect_bd_net [get_bd_pins ilslice_2/Dout] [get_bd_pins axi_pixel_fifo_2/read_enable]
connect_bd_net [get_bd_pins ilslice_3/Dout] [get_bd_pins axi_pixel_fifo_3/read_enable]
connect_bd_net [get_bd_pins ilslice_4/Dout] [get_bd_pins axi_pixel_fifo_4/read_enable]
connect_bd_net [get_bd_pins ilslice_5/Dout] [get_bd_pins axi_pixel_fifo_5/read_enable]
connect_bd_net [get_bd_pins ilslice_6/Dout] [get_bd_pins axi_pixel_fifo_6/read_enable]
connect_bd_net [get_bd_pins ilslice_7/Dout] [get_bd_pins axi_pixel_fifo_7/read_enable]
connect_bd_net [get_bd_pins ilslice_8/Dout] [get_bd_pins axi_pixel_fifo_8/read_enable]
connect_bd_net [get_bd_pins ilslice_9/Dout] [get_bd_pins axi_pixel_fifo_9/read_enable]
connect_bd_net [get_bd_pins io_waits1/dout] [get_bd_pins ilreduced_logic_0/Op1]
connect_bd_net -net read_completes [get_bd_pins ilconcat_0/dout] [get_bd_pins axi_fifo_sequencer_0/read_completes]
connect_bd_net -net read_enables [get_bd_pins axi_fifo_sequencer_0/read_enables] \
  [get_bd_pins ilslice_13/Din] [get_bd_pins ilslice_12/Din] [get_bd_pins ilslice_11/Din] [get_bd_pins ilslice_10/Din] \
  [get_bd_pins ilslice_9/Din] [get_bd_pins ilslice_8/Din] [get_bd_pins ilslice_7/Din] [get_bd_pins ilslice_6/Din] \
  [get_bd_pins ilslice_5/Din] [get_bd_pins ilslice_4/Din] [get_bd_pins ilslice_3/Din] [get_bd_pins ilslice_2/Din] \
  [get_bd_pins ilslice_1/Din] [get_bd_pins ilslice_0/Din]
connect_bd_net [get_bd_pins tft_ili9341_wrapper_0/io_wait] [get_bd_pins io_waits1/In0]
connect_bd_net [get_bd_pins tft_ili9341_wrapper_0/ready] [get_bd_pins tft_ili9341_wrapper_1/aresetn]
connect_bd_net [get_bd_pins tft_ili9341_wrapper_0/tft_led] [get_bd_pins ilconcat_leds/In0]
connect_bd_net [get_bd_pins tft_ili9341_wrapper_0/tft_nrst] [get_bd_pins ilconcat_resets/In0]
connect_bd_net [get_bd_pins tft_ili9341_wrapper_10/io_wait] [get_bd_pins io_waits1/In10]
connect_bd_net [get_bd_pins tft_ili9341_wrapper_10/ready] [get_bd_pins tft_ili9341_wrapper_11/aresetn]
connect_bd_net [get_bd_pins tft_ili9341_wrapper_10/tft_led] [get_bd_pins ilconcat_leds/In10]
connect_bd_net [get_bd_pins tft_ili9341_wrapper_10/tft_nrst] [get_bd_pins ilconcat_resets/In10]
connect_bd_net [get_bd_pins tft_ili9341_wrapper_11/io_wait] [get_bd_pins io_waits1/In11]
connect_bd_net [get_bd_pins tft_ili9341_wrapper_11/ready] [get_bd_pins tft_ili9341_wrapper_12/aresetn]
connect_bd_net [get_bd_pins tft_ili9341_wrapper_11/tft_led] [get_bd_pins ilconcat_leds/In11]
connect_bd_net [get_bd_pins tft_ili9341_wrapper_11/tft_nrst] [get_bd_pins ilconcat_resets/In11]
connect_bd_net [get_bd_pins tft_ili9341_wrapper_12/io_wait] [get_bd_pins io_waits1/In12]
connect_bd_net [get_bd_pins tft_ili9341_wrapper_12/ready] [get_bd_pins tft_ili9341_wrapper_13/aresetn]
connect_bd_net [get_bd_pins tft_ili9341_wrapper_12/tft_led] [get_bd_pins ilconcat_leds/In12]
connect_bd_net [get_bd_pins tft_ili9341_wrapper_12/tft_nrst] [get_bd_pins ilconcat_resets/In12]
connect_bd_net [get_bd_pins tft_ili9341_wrapper_13/io_wait] [get_bd_pins io_waits1/In13]
connect_bd_net [get_bd_pins tft_ili9341_wrapper_13/tft_led] [get_bd_pins ilconcat_leds/In13]
connect_bd_net [get_bd_pins tft_ili9341_wrapper_13/tft_nrst] [get_bd_pins ilconcat_resets/In13]
connect_bd_net [get_bd_pins tft_ili9341_wrapper_1/io_wait] [get_bd_pins io_waits1/In1]
connect_bd_net [get_bd_pins tft_ili9341_wrapper_1/ready] [get_bd_pins tft_ili9341_wrapper_2/aresetn]
connect_bd_net [get_bd_pins tft_ili9341_wrapper_1/tft_led] [get_bd_pins ilconcat_leds/In1]
connect_bd_net [get_bd_pins tft_ili9341_wrapper_1/tft_nrst] [get_bd_pins ilconcat_resets/In1]
connect_bd_net [get_bd_pins tft_ili9341_wrapper_2/io_wait] [get_bd_pins io_waits1/In2]
connect_bd_net [get_bd_pins tft_ili9341_wrapper_2/ready] [get_bd_pins tft_ili9341_wrapper_3/aresetn]
connect_bd_net [get_bd_pins tft_ili9341_wrapper_2/tft_led] [get_bd_pins ilconcat_leds/In2]
connect_bd_net [get_bd_pins tft_ili9341_wrapper_2/tft_nrst] [get_bd_pins ilconcat_resets/In2]
connect_bd_net [get_bd_pins tft_ili9341_wrapper_3/io_wait] [get_bd_pins io_waits1/In3]
connect_bd_net [get_bd_pins tft_ili9341_wrapper_3/ready] [get_bd_pins tft_ili9341_wrapper_4/aresetn]
connect_bd_net [get_bd_pins tft_ili9341_wrapper_3/tft_led] [get_bd_pins ilconcat_leds/In3]
connect_bd_net [get_bd_pins tft_ili9341_wrapper_3/tft_nrst] [get_bd_pins ilconcat_resets/In3]
connect_bd_net [get_bd_pins tft_ili9341_wrapper_4/io_wait] [get_bd_pins io_waits1/In4]
connect_bd_net [get_bd_pins tft_ili9341_wrapper_4/ready] [get_bd_pins tft_ili9341_wrapper_5/aresetn]
connect_bd_net [get_bd_pins tft_ili9341_wrapper_4/tft_led] [get_bd_pins ilconcat_leds/In4]
connect_bd_net [get_bd_pins tft_ili9341_wrapper_4/tft_nrst] [get_bd_pins ilconcat_resets/In4]
connect_bd_net [get_bd_pins tft_ili9341_wrapper_5/io_wait] [get_bd_pins io_waits1/In5]
connect_bd_net [get_bd_pins tft_ili9341_wrapper_5/ready] [get_bd_pins tft_ili9341_wrapper_6/aresetn]
connect_bd_net [get_bd_pins tft_ili9341_wrapper_5/tft_led] [get_bd_pins ilconcat_leds/In5]
connect_bd_net [get_bd_pins tft_ili9341_wrapper_5/tft_nrst] [get_bd_pins ilconcat_resets/In5]
connect_bd_net [get_bd_pins tft_ili9341_wrapper_6/io_wait] [get_bd_pins io_waits1/In6]
connect_bd_net [get_bd_pins tft_ili9341_wrapper_6/ready] [get_bd_pins tft_ili9341_wrapper_7/aresetn]
connect_bd_net [get_bd_pins tft_ili9341_wrapper_6/tft_led] [get_bd_pins ilconcat_leds/In6]
connect_bd_net [get_bd_pins tft_ili9341_wrapper_6/tft_nrst] [get_bd_pins ilconcat_resets/In6]
connect_bd_net [get_bd_pins tft_ili9341_wrapper_7/io_wait] [get_bd_pins io_waits1/In7]
connect_bd_net [get_bd_pins tft_ili9341_wrapper_7/ready] [get_bd_pins tft_ili9341_wrapper_8/aresetn]
connect_bd_net [get_bd_pins tft_ili9341_wrapper_7/tft_led] [get_bd_pins ilconcat_leds/In7]
connect_bd_net [get_bd_pins tft_ili9341_wrapper_7/tft_nrst] [get_bd_pins ilconcat_resets/In7]
connect_bd_net [get_bd_pins tft_ili9341_wrapper_8/io_wait] [get_bd_pins io_waits1/In8]
connect_bd_net [get_bd_pins tft_ili9341_wrapper_8/ready] [get_bd_pins tft_ili9341_wrapper_9/aresetn]
connect_bd_net [get_bd_pins tft_ili9341_wrapper_8/tft_led] [get_bd_pins ilconcat_leds/In8]
connect_bd_net [get_bd_pins tft_ili9341_wrapper_8/tft_nrst] [get_bd_pins ilconcat_resets/In8]
connect_bd_net [get_bd_pins tft_ili9341_wrapper_9/io_wait] [get_bd_pins io_waits1/In9]
connect_bd_net [get_bd_pins tft_ili9341_wrapper_9/ready] [get_bd_pins tft_ili9341_wrapper_10/aresetn]
connect_bd_net [get_bd_pins tft_ili9341_wrapper_9/tft_led] [get_bd_pins ilconcat_leds/In9]
connect_bd_net [get_bd_pins tft_ili9341_wrapper_9/tft_nrst] [get_bd_pins ilconcat_resets/In9]

current_bd_instance /ps
connect_bd_intf_net [get_bd_intf_pins processing_system7_0/FIXED_IO] [get_bd_intf_pins FIXED_IO]
connect_bd_intf_net [get_bd_intf_pins axi_smc/M02_AXI] [get_bd_intf_pins M02_AXI]
connect_bd_intf_net [get_bd_intf_pins axi_ethernetlite_0/MDIO] [get_bd_intf_pins ETH_MDIO]
connect_bd_intf_net [get_bd_intf_pins processing_system7_0/DDR] [get_bd_intf_pins DDR]
connect_bd_intf_net [get_bd_intf_pins axi_ethernetlite_0/MII] [get_bd_intf_pins ETH_MII]
connect_bd_intf_net [get_bd_intf_pins axi_smc/M03_AXI] [get_bd_intf_pins M03_AXI]
connect_bd_intf_net [get_bd_intf_pins M_AXIS_MM2S] [get_bd_intf_pins axi_dma_0/M_AXIS_MM2S]
connect_bd_intf_net [get_bd_intf_pins axi_dma_0/M_AXI_MM2S] [get_bd_intf_pins axi_smc1/S00_AXI]
connect_bd_intf_net [get_bd_intf_pins processing_system7_0/S_AXI_HP0] [get_bd_intf_pins axi_smc1/M00_AXI]
connect_bd_intf_net [get_bd_intf_pins axi_smc/M00_AXI] [get_bd_intf_pins axi_ethernetlite_0/S_AXI]
connect_bd_intf_net [get_bd_intf_pins axi_smc/M01_AXI] [get_bd_intf_pins axi_dma_0/S_AXI_LITE]
connect_bd_intf_net [get_bd_intf_pins axi_smc/S00_AXI] [get_bd_intf_pins processing_system7_0/M_AXI_GP0]
connect_bd_net [get_bd_pins axi_dma_0/mm2s_introut] [get_bd_pins ilconcat_0/In1]
connect_bd_net [get_bd_pins axi_ethernetlite_0/ip2intc_irpt] [get_bd_pins ilconcat_0/In0]
connect_bd_net [get_bd_pins ilconcat_0/dout] [get_bd_pins processing_system7_0/IRQ_F2P]
connect_bd_net [get_bd_pins ilslice_1/Dout] [get_bd_pins Dout1]
connect_bd_net [get_bd_pins processing_system7_0/FCLK_CLK0] \
  [get_bd_pins processing_system7_0/M_AXI_GP0_ACLK] [get_bd_pins axi_smc/aclk] [get_bd_pins FCLK_CLK0] \
  [get_bd_pins processing_system7_0/S_AXI_HP0_ACLK] [get_bd_pins axi_ethernetlite_0/s_axi_aclk] \
  [get_bd_pins axi_dma_0/m_axi_mm2s_aclk] [get_bd_pins axi_dma_0/s_axi_lite_aclk] [get_bd_pins axi_smc1/aclk]
connect_bd_net [get_bd_pins processing_system7_0/FCLK_CLK1] [get_bd_pins FCLK_CLK1] [get_bd_pins rst_ps7_0_50M/slowest_sync_clk]
connect_bd_net [get_bd_pins processing_system7_0/FCLK_RESET0_N] [get_bd_pins rst_ps7_0_50M/ext_reset_in]
connect_bd_net -net rst_ps7_0_50M_peripheral_aresetn [get_bd_pins ilslice_0/Dout] \
  [get_bd_pins axi_smc/aresetn] [get_bd_pins axi_ethernetlite_0/s_axi_aresetn] [get_bd_pins axi_dma_0/axi_resetn] \
  [get_bd_pins axi_smc1/aresetn] [get_bd_pins Dout]
connect_bd_net [get_bd_pins rst_ps7_0_50M/peripheral_aresetn] [get_bd_pins ilslice_0/Din] [get_bd_pins ilslice_1/Din]

current_bd_instance /
connect_bd_intf_net [get_bd_intf_pins axis_clock_converter_0/M_AXIS] [get_bd_intf_pins displays/S_AXIS]
connect_bd_intf_net [get_bd_intf_ports ILI_0] [get_bd_intf_pins displays/m_tftspi_0]
connect_bd_intf_net [get_bd_intf_ports ILI_1] [get_bd_intf_pins displays/m_tftspi_1]
connect_bd_intf_net [get_bd_intf_ports ILI_2] [get_bd_intf_pins displays/m_tftspi_2]
connect_bd_intf_net [get_bd_intf_ports ILI_3] [get_bd_intf_pins displays/m_tftspi_3]
connect_bd_intf_net [get_bd_intf_ports ILI_4] [get_bd_intf_pins displays/m_tftspi_4]
connect_bd_intf_net [get_bd_intf_ports ILI_5] [get_bd_intf_pins displays/m_tftspi_5]
connect_bd_intf_net [get_bd_intf_ports ILI_6] [get_bd_intf_pins displays/m_tftspi_6]
connect_bd_intf_net [get_bd_intf_ports ILI_7] [get_bd_intf_pins displays/m_tftspi_7]
connect_bd_intf_net [get_bd_intf_ports ILI_8] [get_bd_intf_pins displays/m_tftspi_8]
connect_bd_intf_net [get_bd_intf_ports ILI_9] [get_bd_intf_pins displays/m_tftspi_9]
connect_bd_intf_net [get_bd_intf_ports ILI_A] [get_bd_intf_pins displays/m_tftspi_10]
connect_bd_intf_net [get_bd_intf_ports ILI_B] [get_bd_intf_pins displays/m_tftspi_11]
connect_bd_intf_net [get_bd_intf_ports ILI_C] [get_bd_intf_pins displays/m_tftspi_12]
connect_bd_intf_net [get_bd_intf_ports ILI_D] [get_bd_intf_pins displays/m_tftspi_13]
connect_bd_intf_net [get_bd_intf_ports DDR] [get_bd_intf_pins ps/DDR]
connect_bd_intf_net [get_bd_intf_ports ETH_MDIO] [get_bd_intf_pins ps/ETH_MDIO]
connect_bd_intf_net [get_bd_intf_ports ETH_MII] [get_bd_intf_pins ps/ETH_MII]
connect_bd_intf_net [get_bd_intf_ports FIXED_IO] [get_bd_intf_pins ps/FIXED_IO]
connect_bd_intf_net [get_bd_intf_pins ps/M02_AXI] [get_bd_intf_pins sregs/S_AXI]
connect_bd_intf_net [get_bd_intf_pins ps/M03_AXI] [get_bd_intf_pins sregs/S_AXI1]
connect_bd_intf_net [get_bd_intf_pins axis_clock_converter_0/S_AXIS] [get_bd_intf_pins ps/M_AXIS_MM2S]
connect_bd_net [get_bd_pins discrete_clock_conve_0/data_out] [get_bd_pins sregs/led_inps]
connect_bd_net [get_bd_pins discrete_clock_conve_1/data_out] [get_bd_pins sregs/rst_inps]
connect_bd_net [get_bd_pins discrete_clock_conve_2/data_out] [get_bd_pins sregs/io_wait]
connect_bd_net [get_bd_pins discrete_clock_conve_3/data_out] [get_bd_pins displays/io_ready]
connect_bd_net [get_bd_pins displays/io_wait] [get_bd_pins discrete_clock_conve_2/data_inp]
connect_bd_net [get_bd_pins displays/led_outps] [get_bd_pins discrete_clock_conve_0/data_inp]
connect_bd_net [get_bd_pins displays/rst_outp] [get_bd_pins discrete_clock_conve_1/data_inp]
connect_bd_net -net processing_system7_0_FCLK_CLK0 [get_bd_pins ps/FCLK_CLK0] \
  [get_bd_pins sregs/clk_in1] [get_bd_pins axis_clock_converter_0/s_axis_aclk] [get_bd_pins discrete_clock_conve_0/out_clock] \
  [get_bd_pins discrete_clock_conve_1/out_clock] [get_bd_pins discrete_clock_conve_2/out_clock] \
  [get_bd_pins discrete_clock_conve_3/inp_clock]
connect_bd_net [get_bd_pins ps/Dout] \
  [get_bd_pins axis_clock_converter_0/s_axis_aresetn] [get_bd_pins sregs/resetn] \
  [get_bd_pins discrete_clock_conve_0/out_resetn] [get_bd_pins discrete_clock_conve_1/out_resetn] \
  [get_bd_pins discrete_clock_conve_2/out_resetn] [get_bd_pins discrete_clock_conve_3/inp_resetn]
connect_bd_net [get_bd_pins ps/Dout1] \
  [get_bd_pins axis_clock_converter_0/m_axis_aresetn] [get_bd_pins displays/axis_aresetn] \
  [get_bd_pins discrete_clock_conve_0/inp_resetn] [get_bd_pins discrete_clock_conve_1/inp_resetn] \
  [get_bd_pins discrete_clock_conve_2/inp_resetn] [get_bd_pins discrete_clock_conve_3/out_resetn]
connect_bd_net -net s_axis_clock_1 [get_bd_pins ps/FCLK_CLK1] \
  [get_bd_pins axis_clock_converter_0/m_axis_aclk] [get_bd_pins displays/s_axis_clock] \
  [get_bd_pins discrete_clock_conve_0/inp_clock] [get_bd_pins discrete_clock_conve_1/inp_clock] \
  [get_bd_pins discrete_clock_conve_2/inp_clock] [get_bd_pins discrete_clock_conve_3/out_clock]
connect_bd_net -net shift_register_gpio_0_driver_clock [get_bd_pins sregs/rst595_clock] [get_bd_ports rst595_clock]
connect_bd_net -net shift_register_gpio_0_driver_data [get_bd_pins sregs/rst595_data] [get_bd_ports rst595_data]
connect_bd_net -net shift_register_gpio_0_driver_latch [get_bd_pins sregs/rst595_latch] [get_bd_ports rst595_latch]
connect_bd_net -net shift_register_gpio_0_driver_reset [get_bd_pins sregs/rst595_resetn] [get_bd_ports rst595_resetn]
connect_bd_net -net shift_register_gpio_1_driver_clock [get_bd_pins sregs/led595_clock] [get_bd_ports led595_clock]
connect_bd_net -net shift_register_gpio_1_driver_data [get_bd_pins sregs/led595_data] [get_bd_ports led595_data]
connect_bd_net -net shift_register_gpio_1_driver_latch [get_bd_pins sregs/led595_latch] [get_bd_ports led595_latch]
connect_bd_net -net shift_register_gpio_1_driver_reset [get_bd_pins sregs/led595_resetn] [get_bd_ports led595_resetn]
connect_bd_net [get_bd_pins sregs/io_ready] [get_bd_pins discrete_clock_conve_3/data_inp]

# ---- address map ----
assign_bd_address -offset 0x00000000 -range 512M -target_address_space [get_bd_addr_spaces ps/axi_dma_0/Data_MM2S] [get_bd_addr_segs ps/processing_system7_0/S_AXI_HP0/HP0_DDR_LOWOCM]
assign_bd_address -offset 0x40400000 -range 64K -target_address_space [get_bd_addr_spaces ps/processing_system7_0/Data] [get_bd_addr_segs ps/axi_dma_0/S_AXI_LITE/Reg]
assign_bd_address -offset 0x40E00000 -range 64K -target_address_space [get_bd_addr_spaces ps/processing_system7_0/Data] [get_bd_addr_segs ps/axi_ethernetlite_0/S_AXI/Reg]
assign_bd_address -offset 0x41200000 -range 64K -target_address_space [get_bd_addr_spaces ps/processing_system7_0/Data] [get_bd_addr_segs sregs/axi_gpio_led/S_AXI/Reg]
assign_bd_address -offset 0x41210000 -range 64K -target_address_space [get_bd_addr_spaces ps/processing_system7_0/Data] [get_bd_addr_segs sregs/axi_gpio_rst/S_AXI/Reg]

validate_bd_design
save_bd_design
